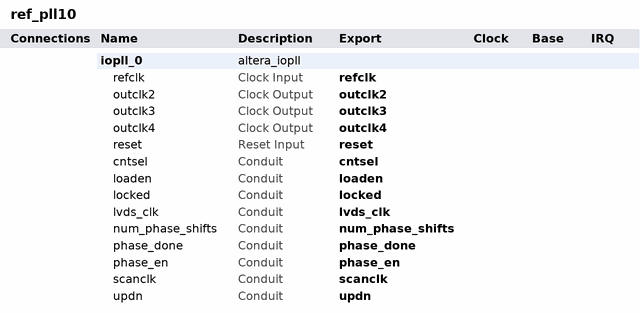
[diagram p0: system contents]
# Platform Designer (Qsys) system ref_pll10, Arria 10 10AX048E3F29E2SG
# Parameters at their usual value, and those the tool derives, are not listed.
package require -exact qsys 23.1
create_system ref_pll10
set_project_property DEVICE_FAMILY {Arria 10}
set_project_property DEVICE 10AX048E3F29E2SG

add_instance iopll_0 altera_iopll 23.1
set_instance_property iopll_0 AUTO_EXPORT true
set_instance_parameter_value iopll_0 gui_c_cnt_in_src0 c_m_cnt_in_src_ph_mux_clk
set_instance_parameter_value iopll_0 gui_c_cnt_in_src1 c_m_cnt_in_src_ph_mux_clk
set_instance_parameter_value iopll_0 gui_c_cnt_in_src2 c_m_cnt_in_src_ph_mux_clk
set_instance_parameter_value iopll_0 gui_c_cnt_in_src3 c_m_cnt_in_src_ph_mux_clk
set_instance_parameter_value iopll_0 gui_c_cnt_in_src4 c_m_cnt_in_src_ph_mux_clk
set_instance_parameter_value iopll_0 gui_cal_code_hex_file iossm.hex
set_instance_parameter_value iopll_0 gui_cal_converge false
set_instance_parameter_value iopll_0 gui_cal_error cal_clean
set_instance_parameter_value iopll_0 gui_clock_name_global false
set_instance_parameter_value iopll_0 gui_clock_to_compensate 0
set_instance_parameter_value iopll_0 gui_debug_mode false
set_instance_parameter_value iopll_0 gui_divide_factor_c0 1
set_instance_parameter_value iopll_0 gui_divide_factor_c1 8
set_instance_parameter_value iopll_0 gui_divide_factor_c2 8
set_instance_parameter_value iopll_0 gui_divide_factor_c3 5
set_instance_parameter_value iopll_0 gui_divide_factor_c4 40
set_instance_parameter_value iopll_0 gui_duty_cycle1 13.0
set_instance_parameter_value iopll_0 gui_en_adv_params true
set_instance_parameter_value iopll_0 gui_en_dps_ports true
set_instance_parameter_value iopll_0 gui_en_lvds_ports {Enable LVDS_CLK/LOADEN 0}
set_instance_parameter_value iopll_0 gui_existing_mif_file_path {~/pll.mif}
set_instance_parameter_value iopll_0 gui_include_iossm false
set_instance_parameter_value iopll_0 gui_lock_setting {Low Lock Time}
set_instance_parameter_value iopll_0 gui_mif_config_name unnamed
set_instance_parameter_value iopll_0 gui_mif_gen_options {Generate New MIF File}
set_instance_parameter_value iopll_0 gui_multiply_factor 8
set_instance_parameter_value iopll_0 gui_new_mif_file_path {~/pll.mif}
set_instance_parameter_value iopll_0 gui_number_of_clocks 5
set_instance_parameter_value iopll_0 gui_operation_mode direct
set_instance_parameter_value iopll_0 gui_output_clock_frequency0 100.0
set_instance_parameter_value iopll_0 gui_output_clock_frequency1 100.0
set_instance_parameter_value iopll_0 gui_output_clock_frequency2 100.0
set_instance_parameter_value iopll_0 gui_output_clock_frequency3 100.0
set_instance_parameter_value iopll_0 gui_parameter_table_hex_file seq_params_sim.hex
set_instance_parameter_value iopll_0 gui_phase_shift0 500.0
set_instance_parameter_value iopll_0 gui_phase_shift1 7000.0
set_instance_parameter_value iopll_0 gui_phase_shift4 0.0
set_instance_parameter_value iopll_0 gui_pll_cal_done false
set_instance_parameter_value iopll_0 gui_pll_freqcal_en true
set_instance_parameter_value iopll_0 gui_pll_freqcal_req_flag true
set_instance_parameter_value iopll_0 gui_pll_m_cnt_in_src c_m_cnt_in_src_ph_mux_clk
set_instance_parameter_value iopll_0 gui_pll_tclk_mux_en false
set_instance_parameter_value iopll_0 gui_pll_tclk_sel pll_tclk_m_src
set_instance_parameter_value iopll_0 gui_pll_type S10_Simple
set_instance_parameter_value iopll_0 gui_pll_vco_freq_band_0 pll_freq_clk0_disabled
set_instance_parameter_value iopll_0 gui_pll_vco_freq_band_1 pll_freq_clk1_disabled
set_instance_parameter_value iopll_0 gui_reference_clock_frequency 125.0
set_instance_parameter_value iopll_0 gui_use_NDFB_modes false
set_instance_parameter_value iopll_0 gui_use_locked true
set_instance_parameter_value iopll_0 gui_usr_device_speed_grade 1
set_instance_parameter_value iopll_0 gui_vco_frequency 1000.0
set_instance_parameter_value iopll_0 hp_qsys_scripting_mode false
set_instance_parameter_value iopll_0 system_info_device_component 10AX048E3F29E2SG
set_instance_parameter_value iopll_0 system_info_device_speed_grade 2
set_instance_parameter_value iopll_0 system_part_trait_speed_grade 2

# exported interfaces
add_interface cntsel conduit end
set_interface_property cntsel EXPORT_OF iopll_0.cntsel
add_interface loaden conduit end
set_interface_property loaden EXPORT_OF iopll_0.loaden
add_interface locked conduit end
set_interface_property locked EXPORT_OF iopll_0.locked
add_interface lvds_clk conduit end
set_interface_property lvds_clk EXPORT_OF iopll_0.lvds_clk
add_interface num_phase_shifts conduit end
set_interface_property num_phase_shifts EXPORT_OF iopll_0.num_phase_shifts
add_interface outclk2 clock source
set_interface_property outclk2 EXPORT_OF iopll_0.outclk2
add_interface outclk3 clock source
set_interface_property outclk3 EXPORT_OF iopll_0.outclk3
add_interface outclk4 clock source
set_interface_property outclk4 EXPORT_OF iopll_0.outclk4
add_interface phase_done conduit end
set_interface_property phase_done EXPORT_OF iopll_0.phase_done
add_interface phase_en conduit end
set_interface_property phase_en EXPORT_OF iopll_0.phase_en
add_interface refclk clock sink
set_interface_property refclk EXPORT_OF iopll_0.refclk
add_interface reset reset sink
set_interface_property reset EXPORT_OF iopll_0.reset
add_interface scanclk conduit end
set_interface_property scanclk EXPORT_OF iopll_0.scanclk
add_interface updn conduit end
set_interface_property updn EXPORT_OF iopll_0.updn

set_interconnect_requirement {$system} qsys_mm.clockCrossingAdapter HANDSHAKE
set_interconnect_requirement {$system} qsys_mm.enableEccProtection FALSE
set_interconnect_requirement {$system} qsys_mm.insertDefaultSlave FALSE
set_interconnect_requirement {$system} qsys_mm.maxAdditionalLatency 1

save_system ref_pll10.qsys
